# EAGLE schematic UVglasses (EAGLE 8.5.2)
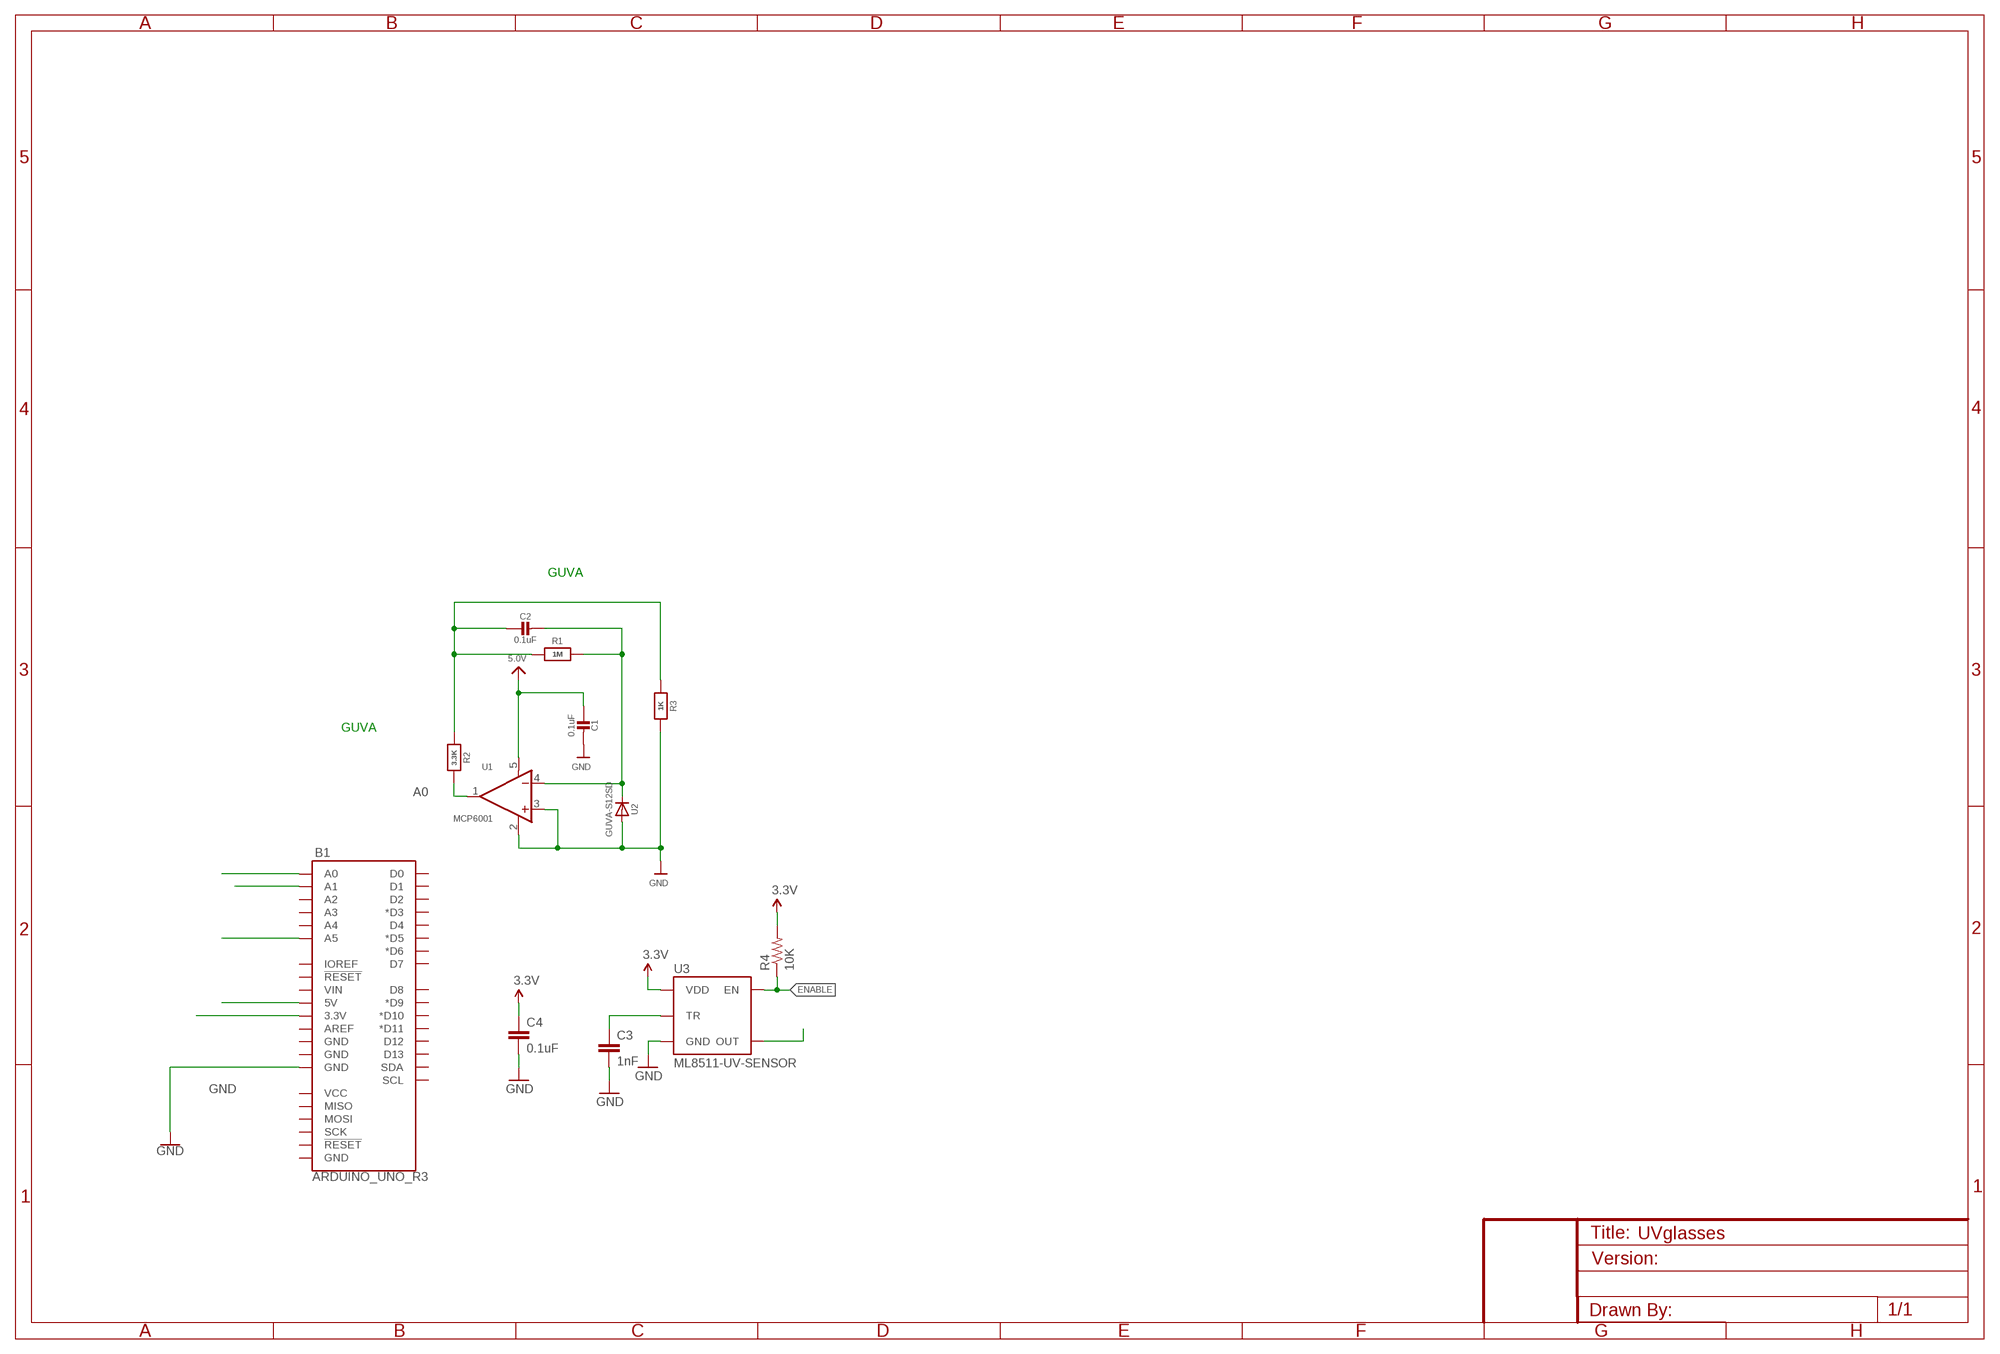
[diagram p0: schematic, sheet 1]

## Parts
B1  ARDUINO_UNO_R3  [ARDUINO_R3]
C1  0.1uF  CAP_CERAMIC0805-NOOUTLINE  [0805-NO]
C2  0.1uF  CAP_CERAMIC0805-NOOUTLINE  [0805-NO]
C3  1nF  1NF/1000PF-50V-10%(0603)  [0603-CAP]
C4  0.1uF  0.1UF-25V(+80/-20%)(0603)  [0603-CAP]
R1  1M  RESISTOR0805_NOOUTLINE  [0805-NO]
R2  3.3K  RESISTOR0805_NOOUTLINE  [0805-NO]
R3  1K  RESISTOR0805_NOOUTLINE  [0805-NO]
R4  10K  10KOHM1/10W1%(0603)0603  [0603-RES]
U1  MCP6001  OPAMP_SINGLESOT235  [SOT23-5]
U2  GUVA-S12SD  UV_GUVA-S12SD  [GUVA-S12SD]
U3  ML8511-UV-SENSOR  ML8511-UV-SENSORSMD  [ML8511]

## Nets
3.3V: B1.3.3V B1.A5 C4.1 R4.2 U3.7(VDD)
5.0V: B1.5V C1.1 U1.5(V+)
A0: B1.A0 R2.1 U1.1(OUT)
A1: B1.A1 U3.8(OUT)
ENABLE: R4.1 U3.4(EN)
GND: B1.GND@2(GND) C1.2 C3.2 C4.2 R3.1 U1.2(V-) U1.3(+IN) U2.A U3.5(GND)
N$1: C2.1 R1.2 R2.2 R3.2
N$2: C2.2 R1.1 U1.4(-IN) U2.K(C)
N$3: C3.1 U3.10(TR)
Unconnected: B1.A2 B1.A3 B1.A4 B1.AREF B1.D0 B1.D1 B1.D2 B1.D3(*D3) B1.D4 B1.D5(*D5) B1.D6(*D6) B1.D7 B1.D8 B1.D9(*D9) B1.D10(*D10) B1.D11(*D11) B1.D12 B1.D13 B1.GND@1(GND) B1.GND@3(GND) B1.GND@4(GND) B1.IOREF B1.MISO B1.MOSI B1.RESET@1(!RESET!) B1.RESET@2(!RESET!) B1.SCK B1.SCL B1.SDA B1.VCC B1.VIN

## Notes on the sheet
- GUVA
- GUVA

## Library data of the parts
B1 = SparkFun-Boards:ARDUINO_UNO_R3: Arduino R3 Footprint with SPI header Arduino Uno R3 Compatible Footprint. Matches PCB size of the original board. SparkFun Products: SAMD21 Dev Breakout <https://www.sparkfun.com/products/13672> RedBoard <https://www.sparkfun.com/products/12757> R3 Stackable Headers <https://www.sparkfun.com/products/11417>
C1 C2 = microbuilder:CAP_CERAMIC: Ceramic Capacitors For new designs, use the packages preceded by an '_' character since they are more reliable: The following footprints should be used on most boards: _0402 - Standard footprint for regular board layouts _0603 - Standard footprint for regular board layouts _0805 - Standard footprint for regular board layouts _1206 - Standard footprint for regular board layouts For extremely tight-pitch boards where space is at a premium, the following 'micro-pitch' footprints can be used (smaller pads, no silkscreen outline, etc.): _0402MP - Micro-pitch footprint for very dense/compact boards _0603MP - Micro-pitch footprint for very dense/compact boards _0805MP - Micro-pitch footprint for very dense/compact boards _1206MP - Micro-pitch footprint for very dense/compact boards
C3 = SparkFun-Capacitors:1NF/1000PF-50V-10%(0603): CAP-07886; PROD_ID: CAP-07886
C4 = SparkFun-Capacitors:0.1UF-25V(+80/-20%)(0603): CAP-00810 Ceramic Standard decoupling cap; PROD_ID: CAP-00810
R1-R3 = microbuilder:RESISTOR: Resistors For new designs, use the packages preceded by an '_' character since they are more reliable: The following footprints should be used on most boards: _0402 - Standard footprint for regular board layouts _0603 - Standard footprint for regular board layouts _0805 - Standard footprint for regular board layouts _1206 - Standard footprint for regular board layouts For extremely tight-pitch boards where space is at a premium, the following 'micro-pitch' footprints can be used (smaller pads, no silkscreen outline, etc.): _0402MP - Micro-pitch footprint for very dense/compact boards _0603MP - Micro-pitch footprint for very dense/compact boards _0805MP - Micro-pitch footprint for very dense/compact boards _1206MP - Micro-pitch footprint for very dense/compact boards
R4 = SparkFun-Resistors:10KOHM1/10W1%(0603): RES-00824; PROD_ID: RES-00824
U1 = microbuilder:OPAMP_SINGLE: Single-Output Op-Amp SOT363 (6-TSSOP) Manuf. ID Slew Rate Gain Bandwidth Prod. -3dB Bandwidth Current Input Bias Voltage Input Offset Supply - Single Supply - Dual Digikey Mouser LMV341MG/NOPB 1V/µs 1MHz -- 0.02pA 25µV 2.4-5.5V LMV341MGTR-ND 926-LMV341MG/NOPB LMH6601MG/NOPB 275V/µs 155MHz 250MHz 5pA 1000µV 2.4-5.5V +/-1.2-2.75V LMH6601MGCT-ND 926-LMH6601MG/NOPB
U2 = microbuilder:UV_GUVA-S12SD: UV Sensor - GUVA-S12SD 240-370nm detection range
U3 = ML8511:ML8511-UV-SENSOR